# EAGLE design PowerSupply (EAGLE 7.6.0)
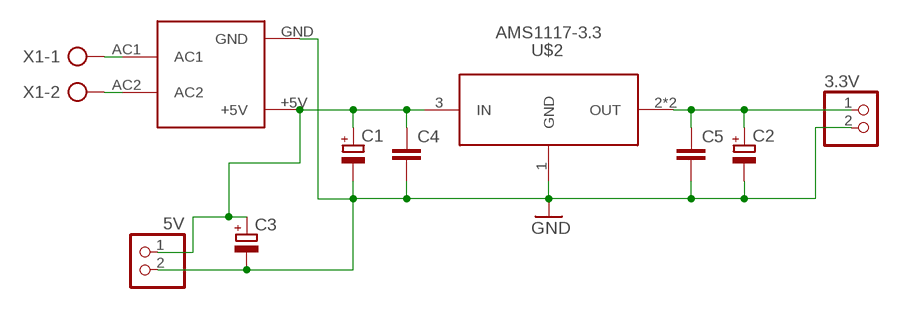
[diagram p0: schematic, sheet 1]

## Parts
3.3V  PINHD-1X2  [1X02]
5V  PINHD-1X2  [1X02]
C1  CPOL-EUB/3528-21R  [B/3528-21R]
C2  CPOL-EUB/3528-21R  [B/3528-21R]
C3  CPOL-EUE2-5  [E2-5]
C4  C-EUC0805K  [C0805K]
C5  C-EUC0805K  [C0805K]
U$1  HLK-PM01  [HLK-PM01]
U$2  AMS1117-3.3  [SOT-223]
X1  AK300/2  [AK300/2]

## Nets
GND: 3.3V.2 5V.2 C1.- C2.- C3.- C4.2 C5.2 U$1.GND U$2.1(GND)
N$1: 5V.1 C1.+ C3.+ C4.1 U$1.+5V U$2.3(IN)
N$2: 3.3V.1 C2.+ C5.1 U$2.2(OUT) U$2.4(OUT)
N$5: U$1.AC1 X1.1
N$6: U$1.AC2 X1.2

## Library data of the parts
3.3V 5V = pinhead:PINHD-1X2: PIN HEADER
C1-C3 = rcl:CPOL-EU: POLARIZED CAPACITOR, European symbol
C4 C5 = rcl:C-EU: CAPACITOR, European symbol
U$1 = HLK-PM01:HLK-PM01
U$2 = AMS1117-3.3:AMS1117-3.3: 1A LOW DROPOUT VOLTAGE REGULATOR
X1 = con-ptr500:AK300/2: CONNECTOR; OC_FARNELL: unknown; OC_NEWARK: unknown

## Board
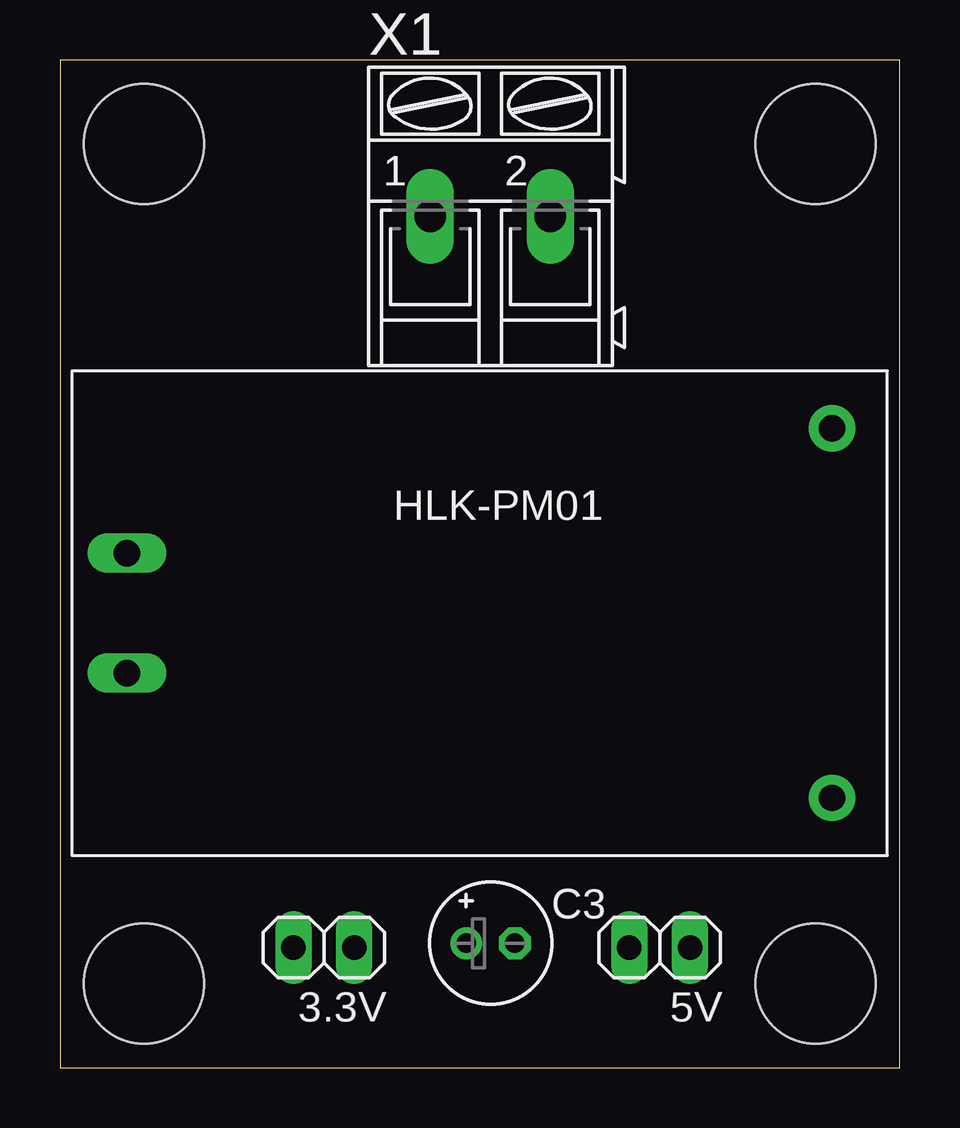
[diagram p1: board, top side]
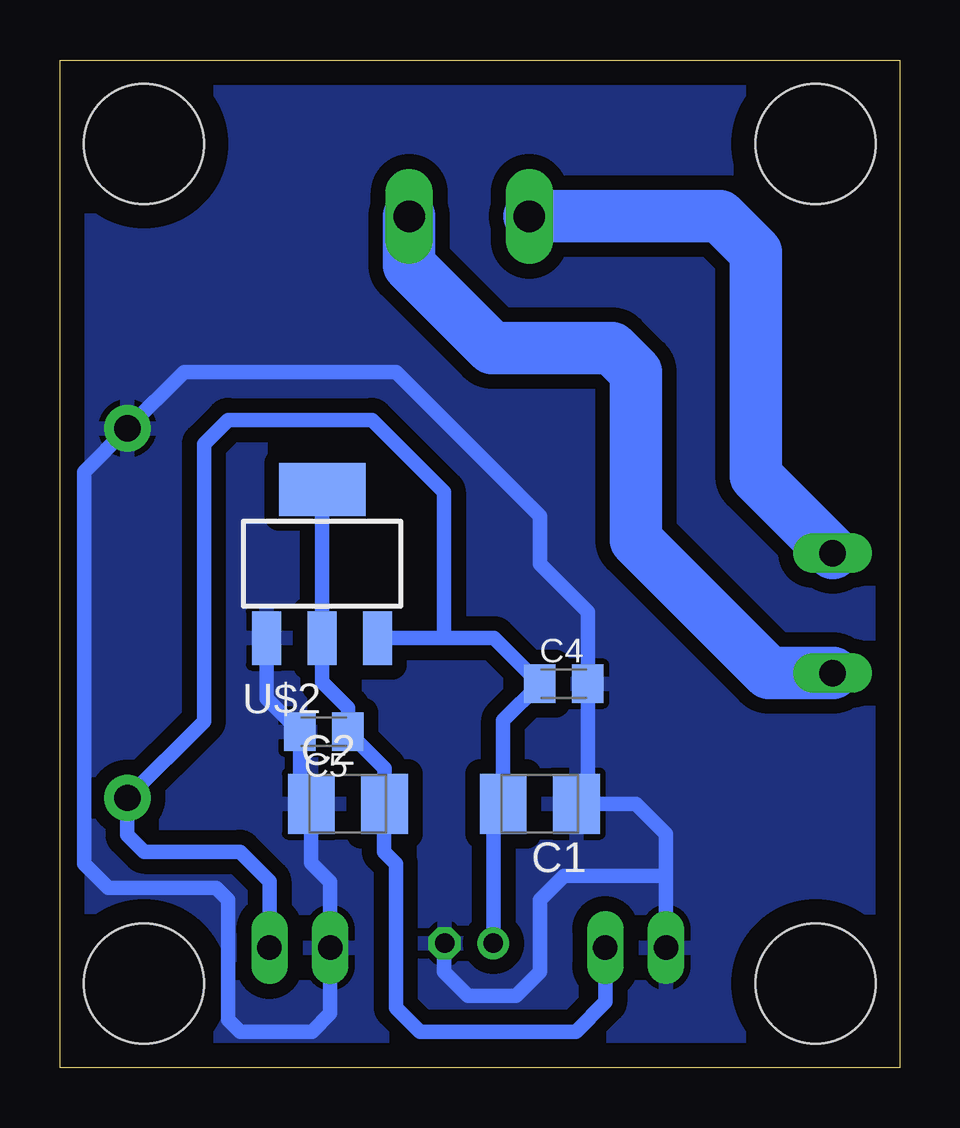
[diagram p2: board, bottom side, seen from below]

Size 35 x 42 mm. Coordinates in mm from the lower left corner, seen from the top.
Outline: 0,0 35,0 35,42 0,42 0,0
Copper layers (1*16): Top 0.035mm / dielectric 1.5mm / Bottom 0.035mm
Design rules "default": minimum track width 10mil, minimum drill 24mil, track to track 8mil, track to pad 8mil, pad to pad 8mil, via to via 8mil, smd to smd 8mil, copper to edge 40mil, drill to drill 8mil, minimum pad ring 10mil, minimum via ring 8mil, stop-mask expansion 4mil, vias tented up to drill 0mil, thermal gap 10mil
Holes 5 mm at 3.5,38.5 31.5,38.5 31.5,3.5 3.5,3.5

### Footprints (pad centres in the part's own frame; a part is rotated, then mirrored left to right if it is on the bottom)
1X02 = drill 1.016 long: 1 -1.27,0; 2 1.27,0
B/3528-21R = smd 1.95 x 2.5: + 1.525,0; - -1.525,0
E2-5 = drill 0.813 pad 1.27: + -1.016,0 | drill 0.813 pad 1.27 octagon: - 1.016,0
C0805K = smd 1.3 x 1.6: 1 -1,0; 2 1,0
HLK-PM01 = drill 1.1 pad 1.93: +5V 15.19,-7.76; GND 15.19,7.64 | drill 1.1 long: AC1 -14.21,2.44; AC2 -14.21,-2.56
SOT-223 = smd 1.219 x 2.235: 1 -2.381,-3.099; 2 -0.07,-3.099; 3 2.241,-3.099 | smd 3.6 x 2.2: 4 -0.07,3.099
AK300/2 = drill 1.321 long: 1 -2.515,0; 2 2.489,0

### Placement (x,y rotation side)
3.3V  11,5 180 top
5V  25,5 180 top
C1  15,11 180 bottom
C2  23,11 0 bottom
C3  17.95,5.18 0 top
C4  14,16 0 bottom
C5  24,14 180 bottom
U$1  17,19 0 top
U$2  24,21 0 bottom
X1  17.95,35.48 0 top

### Tracks (layer width: path | path; a pad name or v marks a point on that pad's centre or on a via)
GND
  Bottom 0.61: C1.- 13,11.47 C4.2 13,19 15,21 15,23 21,29 29.83,29 U$1.GND 34,24.83 34,8.5 33,7.5 28.5,7.5 28,7 28,2 27.5,1.5 24.5,1.5 23.73,2.27 5V.2 23.73,7.73 24.52,8.53 C2.- 25,11.47 C5.2 26.38,15.38 U$2.1 | C1.- 14,11 | C1.- 11,11 9.73,9.73 9.73,8 | 9.73,8 3.3V.2 | C3.- 19,5.15 19,4 18,3 16,3 15,4 15,7 14,8 9.73,8
  pour Bottom (isolate 0.61): 0,0 35,0 35,42 0,42
N$1
  Bottom 0.254: 21.72,18.06 U$2.3
  Bottom 0.61: U$2.3 19,17.9 | 19,17.9 16.9,17.9 C4.1 16.52,14.47 C1.+ 16.93,10.59 C3.+ | 19,17.9 19,24 22,27 28,27 29,26 29,14.43 U$1.+5V 32.19,9.69 31.5,9 27.5,9 26.27,7.77 5V.1
N$2
  Bottom 0.61: 3.3V.1 12.27,2.73 13.5,1.5 20,1.5 21,2.5 21,8.5 21.5,9 21.5,10.97 C2.+ 21.48,12.47 C5.1 23,15 24.07,16.07 U$2.2 U$2.4
N$5
  Bottom 2.184: X1.1 7.48,35.48 6,34 6,24.65 U$1.AC1
N$6
  Bottom 2.184: U$1.AC2 5.44,16.44 11,22 11,29 12,30 17,30 20.44,33.44 X1.2